# EAGLE design XOR gate (EAGLE 6.1)
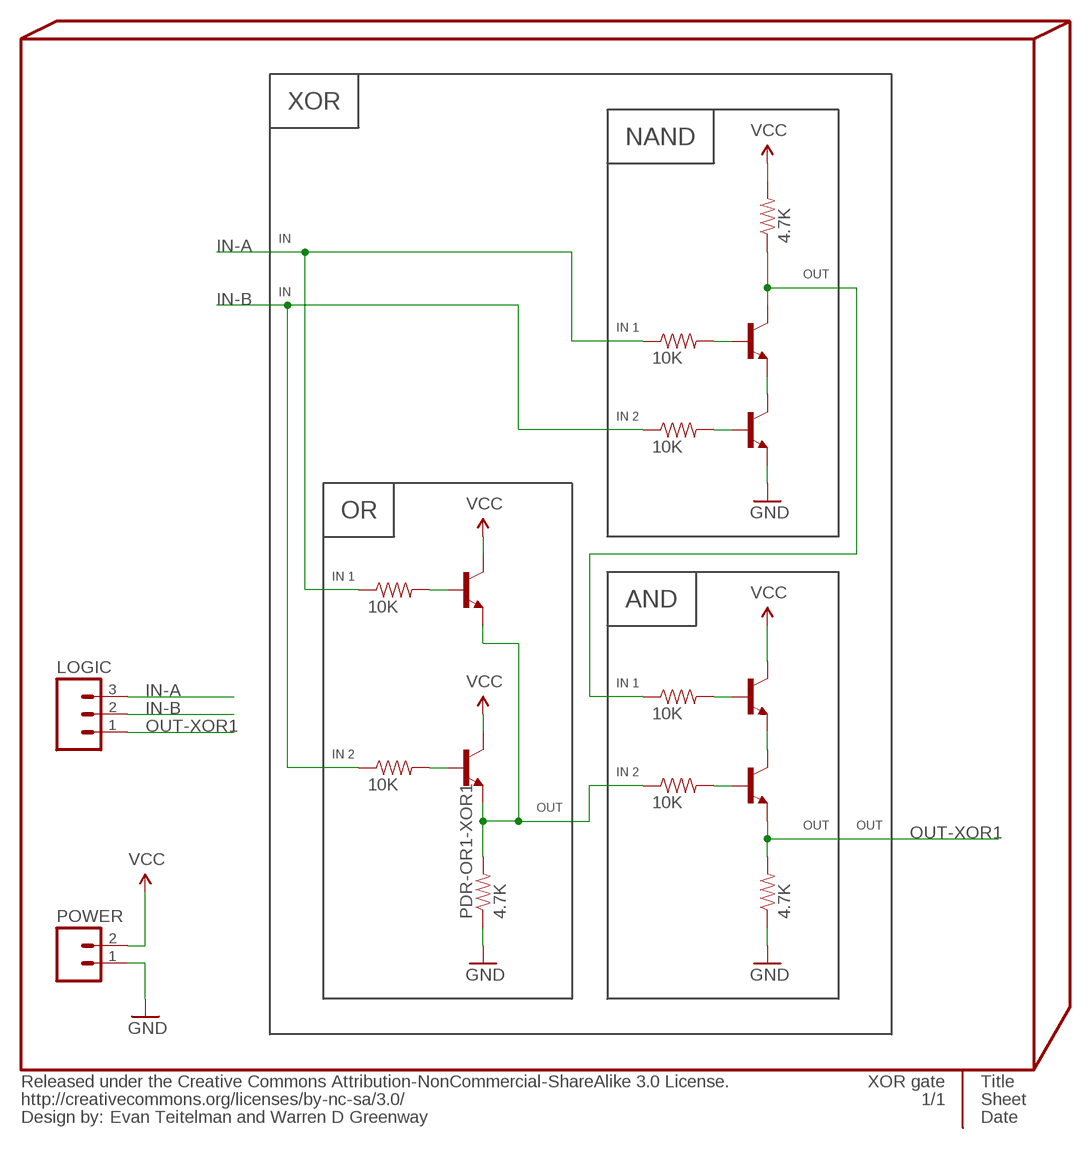
[diagram p0: schematic, sheet 1]

## Parts
INFO4  Evan Teitelman and Warren D Greenway  %CC-NC-SA  [%CC-NC-SA]
LOGIC  M03PTH  [1X03]
PDR-AND1-XOR1  4.7K  RESISTOR0402-RES  [0402-RES]
PDR-OR1-XOR1  4.7K  RESISTOR0402-RES  [0402-RES]
POWER  M02PTH  [1X02]
PUR-NAND1-XOR1  4.7K  RESISTOR0402-RES  [0402-RES]
Q1-AND1-XOR1  TRANSISTOR_NPNSOT23  [SOT23]
Q1-NAND1-XOR1  TRANSISTOR_NPNSOT23  [SOT23]
Q1-OR1-XOR1  TRANSISTOR_NPNSOT23  [SOT23]
Q2-AND1-XOR1  TRANSISTOR_NPNSOT23  [SOT23]
Q2-NAND1-XOR1  TRANSISTOR_NPNSOT23  [SOT23]
Q2-OR1-XOR1  TRANSISTOR_NPNSOT23  [SOT23]
R1-AND1-XOR1  10K  RESISTOR0402-RES  [0402-RES]
R1-NAND1-XOR1  10K  RESISTOR0402-RES  [0402-RES]
R1-OR1-XOR1  10K  RESISTOR0402-RES  [0402-RES]
R2-AND1-XOR1  10K  RESISTOR0402-RES  [0402-RES]
R2-NAND1-XOR1  10K  RESISTOR0402-RES  [0402-RES]
R2-OR1-XOR1  10K  RESISTOR0402-RES  [0402-RES]

## Nets
GND: PDR-AND1-XOR1.1 PDR-OR1-XOR1.1 POWER.1 Q2-NAND1-XOR1.2(E) ; supply symbol labelled @GND
IN-A: LOGIC.3 R1-NAND1-XOR1.1 R1-OR1-XOR1.1
IN-B: LOGIC.2 R2-NAND1-XOR1.1 R2-OR1-XOR1.1
N$1: Q1-OR1-XOR1.1(B) R1-OR1-XOR1.2
N$4: Q2-AND1-XOR1.1(B) R2-AND1-XOR1.2
N$5: Q2-OR1-XOR1.1(B) R2-OR1-XOR1.2
N$6: Q1-AND1-XOR1.1(B) R1-AND1-XOR1.2
N$7: Q1-NAND1-XOR1.1(B) R1-NAND1-XOR1.2
N$8: Q2-NAND1-XOR1.1(B) R2-NAND1-XOR1.2
OUT-NAND1-XOR1: PUR-NAND1-XOR1.1 Q1-NAND1-XOR1.3(C) R1-AND1-XOR1.1
OUT-OR1-XOR1: PDR-OR1-XOR1.2 Q1-OR1-XOR1.2(E) Q2-OR1-XOR1.2(E) R2-AND1-XOR1.1
OUT-XOR1: LOGIC.1 PDR-AND1-XOR1.2 Q2-AND1-XOR1.2(E)
Q-Q-AND1-XOR1: Q1-AND1-XOR1.2(E) Q2-AND1-XOR1.3(C)
Q-Q-NAND1-XOR1: Q1-NAND1-XOR1.2(E) Q2-NAND1-XOR1.3(C)
VCC: POWER.2 PUR-NAND1-XOR1.2 Q1-AND1-XOR1.3(C) Q1-OR1-XOR1.3(C) Q2-OR1-XOR1.3(C) ; supply symbol labelled @VCC

## Notes on the sheet
- XOR
- NAND
- IN
- OUT
- IN
- IN 1
- IN 2
- OR
- IN 1
- AND
- IN 1
- IN 2
- IN 2
- OUT
- OUT | OUT

## Library data of the parts
INFO4 = PygmyBoards:%CC-NC-SA: Released under the Creative Commons Attribution-NonCommercial-ShareAlike 3.0 License. http://creativecommons.org/licenses/by-sa/3.0 Design by: [Designer Name] Change this part's value to change the designer name
LOGIC = SparkFun:M03: Header 3 Standard 3-pin 0.1" header. Use with straight break away headers (SKU : PRT-00116), right angle break away headers (PRT-00553), swiss pins (PRT-00743), machine pins (PRT-00117), and female headers (PRT-00115). Molex polarized connector foot print use with SKU : PRT-08232 with associated crimp pins and housings.
PDR-AND1-XOR1 PDR-OR1-XOR1 PUR-NAND1-XOR1 R1-AND1-XOR1 R1-NAND1-XOR1 R1-OR1-XOR1 R2-AND1-XOR1 R2-NAND1-XOR1 R2-OR1-XOR1 = SparkFun:RESISTOR: Resistor Basic schematic elements and footprints for 0603, 1206, and PTH resistors.
POWER = SparkFun:M02: Header 2 Standard 2-pin 0.1" header. Use with straight break away headers (SKU : PRT-00116), right angle break away headers (PRT-00553), swiss pins (PRT-00743), machine pins (PRT-00117), and female headers (PRT-00115). Molex polarized connector foot print use with SKU : PRT-08233 with associated crimp pins and housings.
Q1-AND1-XOR1 Q1-NAND1-XOR1 Q1-OR1-XOR1 Q2-AND1-XOR1 Q2-NAND1-XOR1 Q2-OR1-XOR1 = SparkFun:TRANSISTOR_NPN: Transistor NPN BJT configuration in SOT23 package. MMBT2222 is the common NPN we use. Double check BCE configuration again layout.

## Board
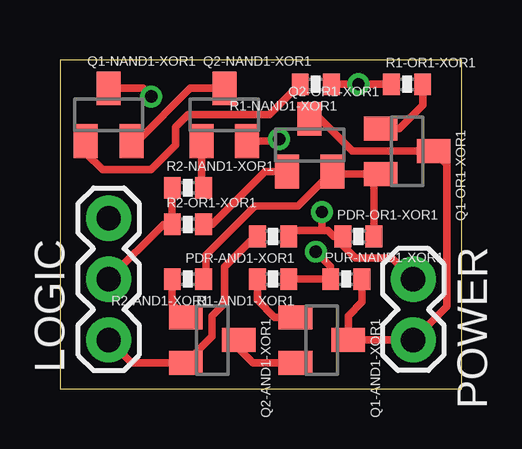
[diagram p1: board, top side]
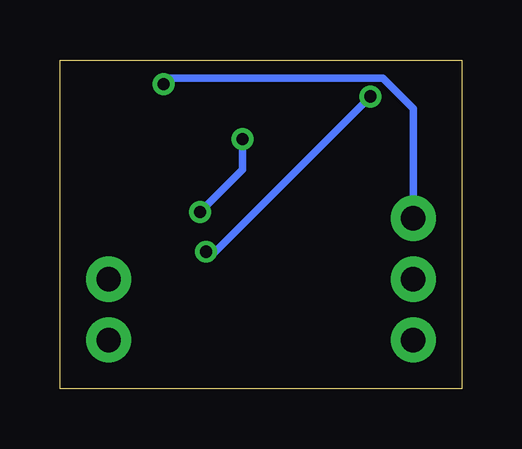
[diagram p2: board, bottom side, seen from below]

Size 16.76 x 13.72 mm. Coordinates in mm from the lower left corner, seen from the top.
Outline: 0,0 16.76,0 16.76,13.72 0,13.72 0,0
Copper layers (1*16): Top 0.035mm / dielectric 1.5mm / Bottom 0.035mm
Design rules: minimum track width 6mil, minimum drill 13mil, track to track 6mil, track to pad 6mil, pad to pad 4mil, via to via 6mil, smd to smd 4mil, copper to edge 15mil, drill to drill 6mil, minimum pad ring 10mil, minimum via ring 8mil, stop-mask expansion 4mil, vias tented up to drill 25mil, thermal gap 10mil

### Footprints (pad centres in the part's own frame; a part is rotated, then mirrored left to right if it is on the bottom)
1X03 = drill 1.016 pad 1.88: 1 0,0; 2 2.54,0; 3 5.08,0
0402-RES = smd 0.7 x 0.9: 1 -0.65,0; 2 0.65,0
1X02 = drill 1.016 pad 1.88: 1 0,0; 2 2.54,0
SOT23 = smd 1 x 1.4: 1 -0.95,-1.1; 2 0.95,-1.1; 3 0,1.1

### Placement (x,y rotation side)
INFO4  0,-7.62 0 top  (outside the outline)
LOGIC  2.03,2.03 90 top
PDR-AND1-XOR1  8.89,6.35 180 top
PDR-OR1-XOR1  12.45,6.35 0 top
POWER  14.73,4.57 270 top
PUR-NAND1-XOR1  11.94,4.57 0 top
Q1-AND1-XOR1  10.92,2.03 270 top
Q1-NAND1-XOR1  2.03,11.43 0 top
Q1-OR1-XOR1  14.48,9.91 270 top
Q2-AND1-XOR1  6.35,2.03 270 top
Q2-NAND1-XOR1  6.86,11.43 0 top
Q2-OR1-XOR1  10.41,10.16 0 top
R1-AND1-XOR1  8.89,4.57 180 top
R1-NAND1-XOR1  10.67,12.7 180 top
R1-OR1-XOR1  14.48,12.7 0 top
R2-AND1-XOR1  5.33,4.57 180 top
R2-NAND1-XOR1  5.33,8.38 0 top
R2-OR1-XOR1  5.33,6.86 0 top

### Tracks (layer width: path | path; a pad name or v marks a point on that pad's centre or on a via)
GND  (via drill 0.51)
  Top 0.305: POWER.1 13.84,5.46 12.32,5.46 11.8,5.98 PDR-OR1-XOR1.1 11.43,6.35 11.18,6.6 10.92,6.6 | Q2-NAND1-XOR1.2 9.06,10.33 v9.14,10.41 | PDR-AND1-XOR1.1 9.79,6.6 10.92,6.6 | 10.92,6.6 v10.92,7.37
  Bottom 0.305: v10.92,7.37 9.14,9.14 v9.14,10.41
IN-A  (via drill 0.51)
  Top 0.305: R1-NAND1-XOR1.1 v12.45,12.7 R1-OR1-XOR1.1
  Bottom 0.305: v12.45,12.7 12.19,12.95 3.3,12.95 2.03,11.68 LOGIC.3
IN-B
  Top 0.305: R2-NAND1-XOR1.1 R2-OR1-XOR1.1 4.32,6.86 LOGIC.2
N$1
  Top 0.305: Q1-OR1-XOR1.1 14.16,10.86 15.13,11.83 R1-OR1-XOR1.2
N$4
  Top 0.305: Q2-AND1-XOR1.1 4.68,3.55 R2-AND1-XOR1.2
N$5
  Top 0.305: R2-OR1-XOR1.2 6.35,6.86 8.55,9.06 Q2-OR1-XOR1.1
N$6
  Top 0.305: R1-AND1-XOR1.2 8.24,3.7 8.96,2.98 Q1-AND1-XOR1.1
N$7
  Top 0.305: R1-NAND1-XOR1.2 8.75,11.43 5.33,11.43 4.83,10.92 4.83,10.16 3.81,9.14 1.78,9.14 1.08,9.84 Q1-NAND1-XOR1.1
N$8
  Top 0.305: R2-NAND1-XOR1.2 5.91,8.46 Q2-NAND1-XOR1.1
OUT-NAND1-XOR1  (via drill 0.51)
  Top 0.305: R1-AND1-XOR1.1 PUR-NAND1-XOR1.1 11.29,5.09 v10.67,5.71 | Q1-NAND1-XOR1.3 3.47,12.53 v3.81,12.19
  Bottom 0.305: v3.81,12.19 10.29,5.71 v10.67,5.71
OUT-OR1-XOR1
  Top 0.305: R2-AND1-XOR1.1 6.1,4.68 6.1,5.59 8.13,7.62 9.92,7.62 Q2-OR1-XOR1.2 11.47,8.96 Q1-OR1-XOR1.2 13.1,8.67 PDR-OR1-XOR1.2
OUT-XOR1
  Top 0.305: PDR-AND1-XOR1.2 8.13,6.35 6.86,5.08 6.86,3.56 6.35,3.05 6.35,2.18 Q2-AND1-XOR1.2 2.98,1.08 LOGIC.1
Q-Q-AND1-XOR1
  Top 0.305: Q1-AND1-XOR1.2 8.06,1.08 7.45,1.69 Q2-AND1-XOR1.3
Q-Q-NAND1-XOR1
  Top 0.305: Q2-NAND1-XOR1.3 5.44,12.53 3.24,10.33 Q1-NAND1-XOR1.2
VCC
  Top 0.305: PUR-NAND1-XOR1.2 12.59,3.61 12.02,3.05 Q1-AND1-XOR1.3 POWER.2 16.13,3.43 16.13,9.36 Q1-OR1-XOR1.3 12.19,9.91 10.84,11.26 Q2-OR1-XOR1.3

### Text on the board
_bsilk: AND | Out | In-B | Gnd | In-A | Vcc